# EasyEDA Pro project ProProject_aDataFlow_v2_pub_2024-01-13.epro, schematic SCH_conn_2.51
Create Date: 2024-01-03; Page Name: P1; Project Name: aDataFlow_v2_pub; Schematic Name: SCH_conn_2.51; Update Date: 2024-01-03; Company: AMAGSTY; Drawed: amagsty; Page Size: -; Part Number: -; Reviewed: -; Version: 2.5
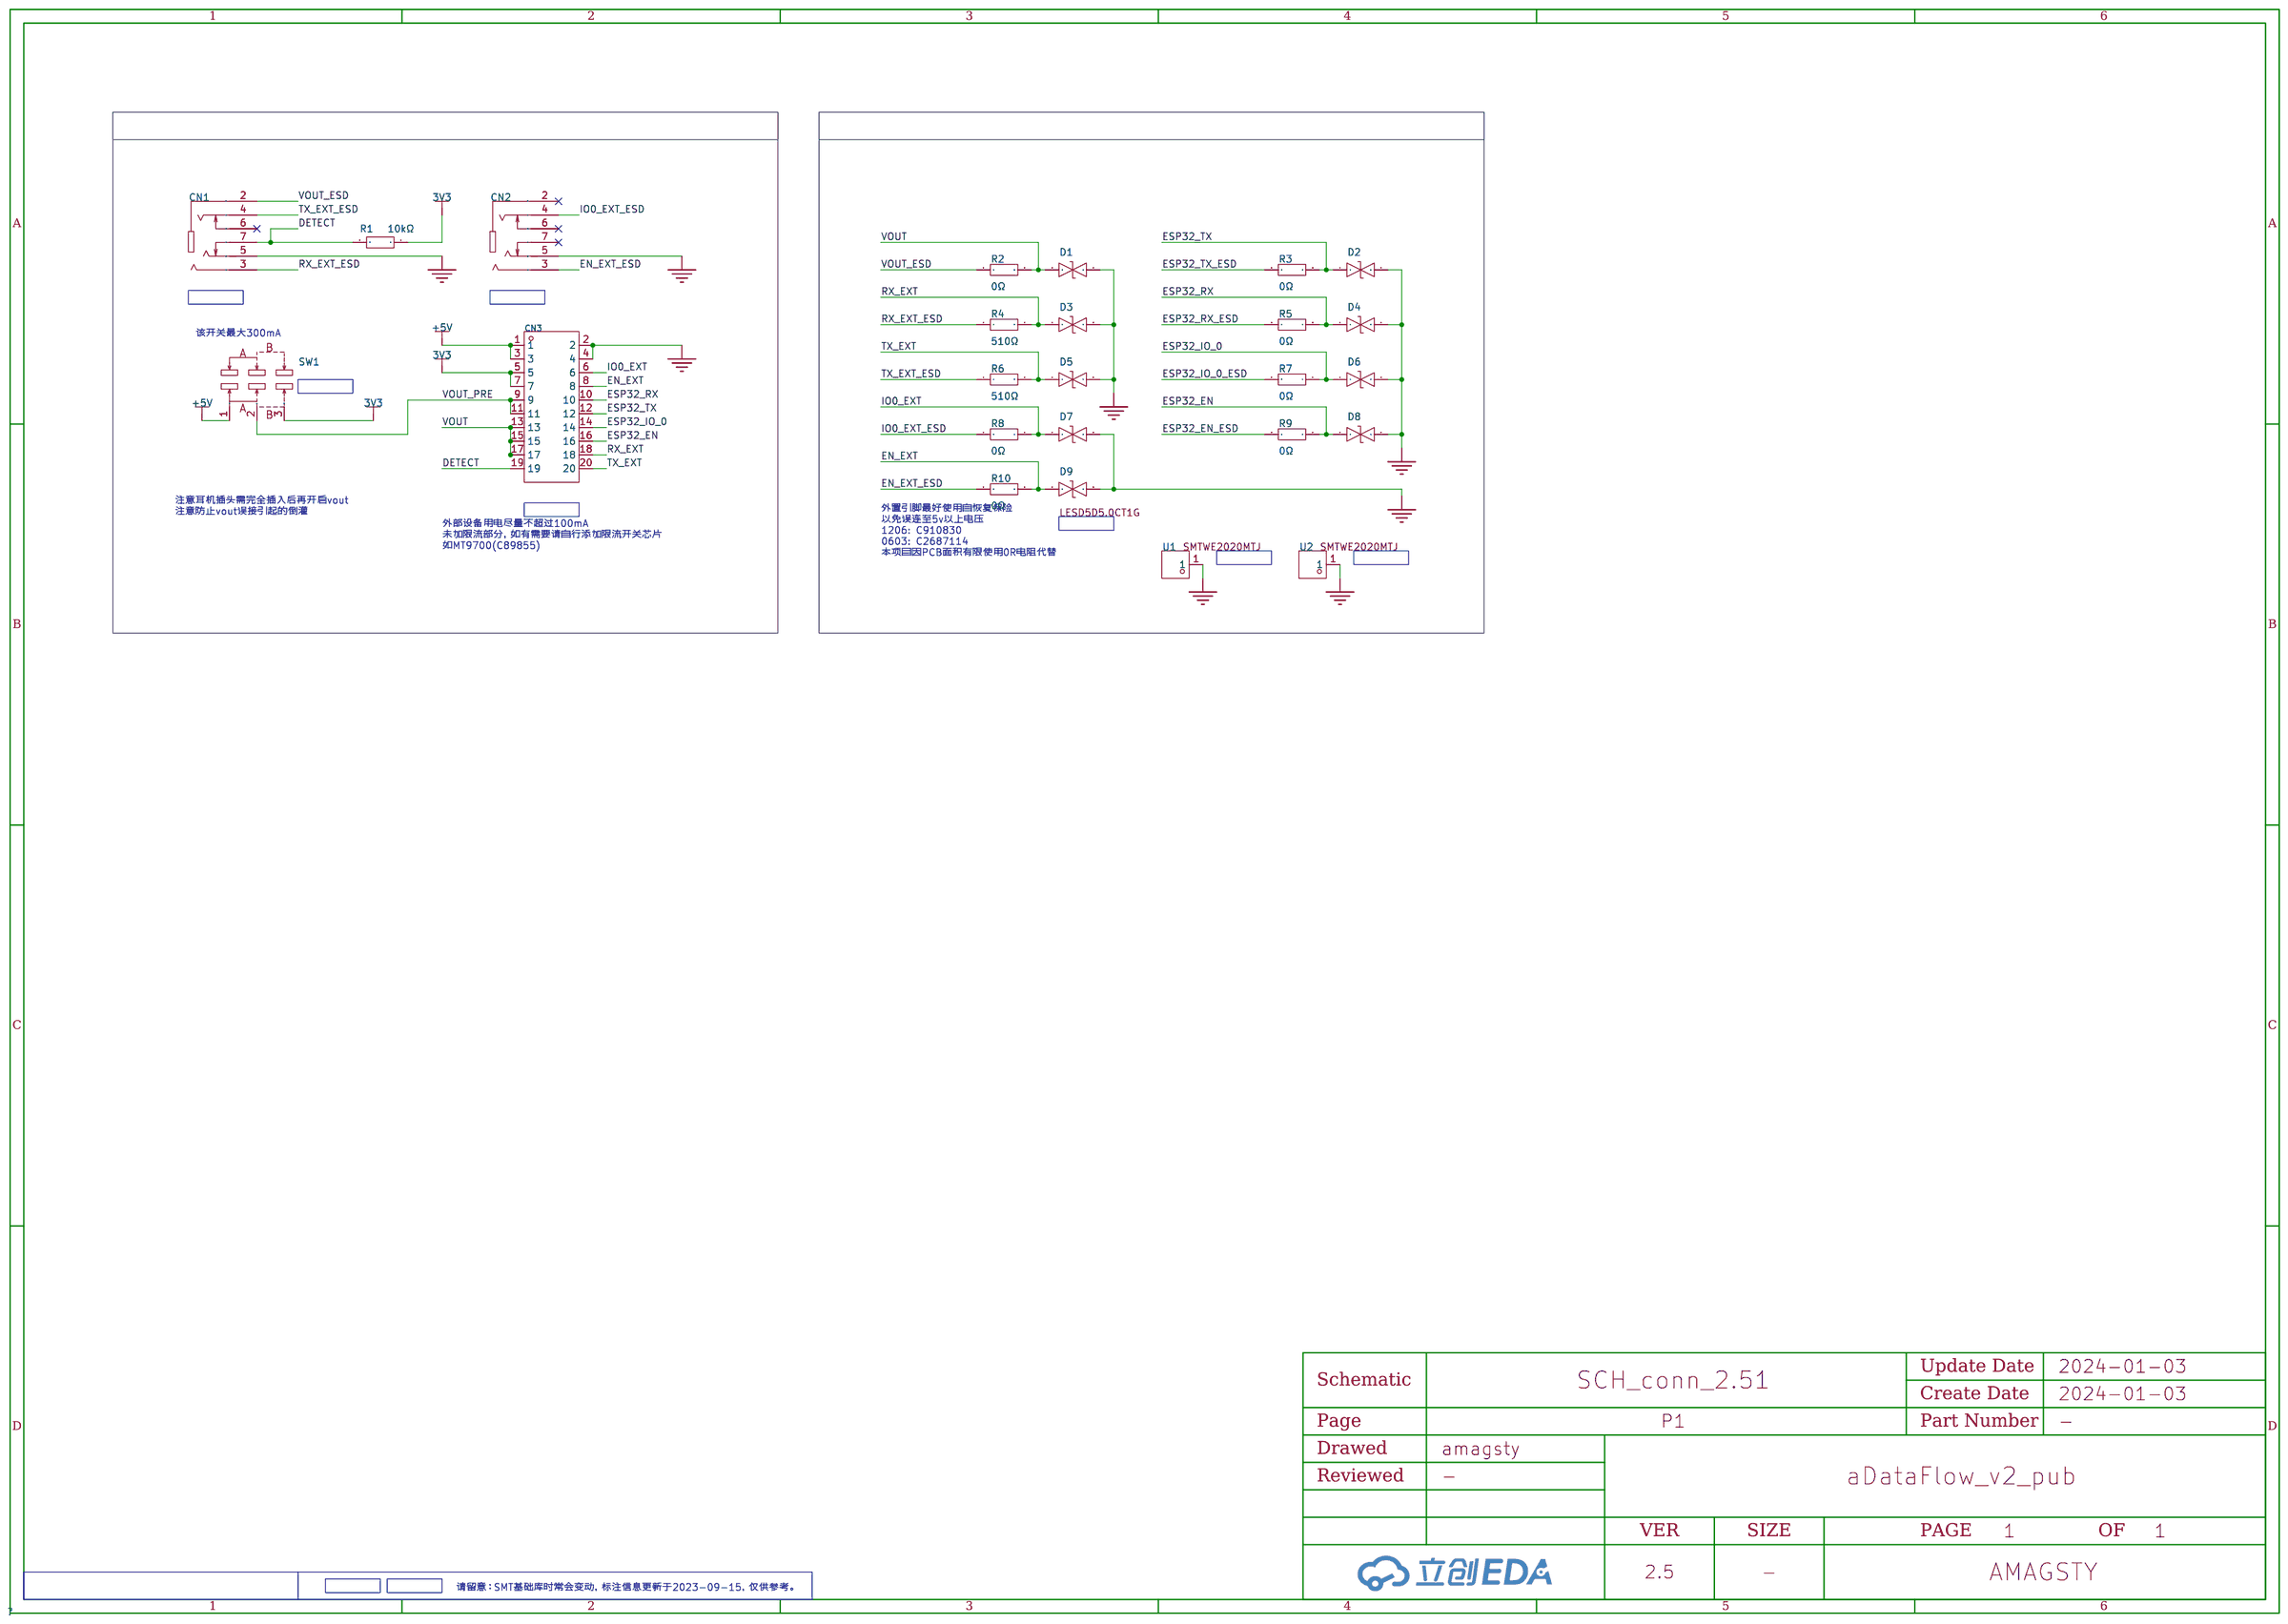
[diagram p0: schematic sheet]

## Parts
CN1  PJ-342  [AUDIO-SMD_PJ-342]
CN2  PJ-342  [AUDIO-SMD_PJ-342]
CN3  X0509FRS-20AS-LPV01  [CONN-SMD_20P-P0.50_XKB_X0509FRS-20ADS-LPV01]
D1  LESD5D5.0CT1G  [SOD-523_L1.2-W0.8-LS1.6-BI]
D2  LESD5D5.0CT1G  [SOD-523_L1.2-W0.8-LS1.6-BI]
D3  LESD5D5.0CT1G  [SOD-523_L1.2-W0.8-LS1.6-BI]
D4  LESD5D5.0CT1G  [SOD-523_L1.2-W0.8-LS1.6-BI]
D5  LESD5D5.0CT1G  [SOD-523_L1.2-W0.8-LS1.6-BI]
D6  LESD5D5.0CT1G  [SOD-523_L1.2-W0.8-LS1.6-BI]
D7  LESD5D5.0CT1G  [SOD-523_L1.2-W0.8-LS1.6-BI]
D8  LESD5D5.0CT1G  [SOD-523_L1.2-W0.8-LS1.6-BI]
D9  LESD5D5.0CT1G  [SOD-523_L1.2-W0.8-LS1.6-BI]
R1  10kΩ  [R0402]
R2  0Ω  [R0402]
R3  0Ω  [R0402]
R4  510Ω  [R0402]
R5  0Ω  [R0402]
R6  510Ω  [R0402]
R7  0Ω  [R0402]
R8  0Ω  [R0402]
R9  0Ω  [R0402]
R10  0Ω  [R0402]
SW1  K3-1280S-K1  [SW-SMD_K3-1280S-K1]
U1  SMTWE2020MTJ  [SMD_BD4.4-L4.4-D2.8]
U2  SMTWE2020MTJ  [SMD_BD4.4-L4.4-D2.8]

## Library data of the parts
CN1 CN2 = PJ-342_C668606: 连接器类型:3.5mm耳机座;额定电流:500mA;额定电压:30V;工作温度范围:-30℃~+70℃;; LCSC Part Name: 3.5mm耳机座; Supplier Part: C668606; Manufacturer: SHOU HAN(首韩); Supplier Footprint: SMD; JLCPCB Part Class: Extended Part; Datasheet: https://atta.szlcsc.com/upload/public/pdf/source/20200618/C668606_D9051A7D9D1D8CCDEAA76A8E7BC279ED.pdf; Supplier: LCSC; Connector Type: 3.5mm耳机座; Current Rating (Max): 500mA; Voltage Rating (Max): 30V; Operating Temperature Range: -30℃~+70℃
CN3 = X0509FRS-20AS-LPV01: PIN总数:20;间距:0.5mm;行数:2;公母:母;安装方式:卧贴;额定电流:3A;工作温度范围:-25℃~+85℃;; LCSC Part Name: PIN：20 间距0.5mm 母 卧贴; Supplier Part: C2925324; Manufacturer: XKB Connectivity(中国星坤); Supplier Footprint: SMD,P=0.5mm; JLCPCB Part Class: 扩展库; Supplier: LCSC; Number of Pins: 20; Pitch: 0.5mm; Number of Rows: 2; Gender: 母; Mounting Style: 卧贴; Current Rating (Max): 3A; Operating Temperature Range: -25℃~+85℃
D1-D9 = LESD5D5.0CT1G: 极性:双向;反向截止电压(Vrwm):5V;击穿电压(VBR):5.6V;钳位电压(Vc)@Ipp:18.6V;; LCSC Part Name: 双向ESD; Supplier Part: C383211; Manufacturer: LRC(乐山无线电); Supplier Footprint: SOD-523; JLCPCB Part Class: 扩展库; Datasheet: https://atta.szlcsc.com/upload/public/pdf/source/20190807/C383211_633DF4B4E2C161403226E5235FE33A1C.pdf; Supplier: LCSC; Polarity: 双向; Reverse Stand-Off Voltage (Vrwm): 5V; Breakdown Voltage (VBR): 5.6V; Peak Pulse Current(Ipp)@8/20us: 9.4A; Clamping Voltage@Ipp: 18.6V
R1 = 0402WGF1002TCE: 电阻类型:厚膜电阻;阻值:10kΩ;精度:±1%;功率:62.5mW;; LCSC Part Name: 10kΩ ±1% 62.5mW; Supplier Part: C25744; Manufacturer: UNI-ROYAL(厚声); Supplier Footprint: 0402; JLCPCB Part Class: 基础库; Datasheet: https://atta.szlcsc.com/upload/public/pdf/source/20200306/C422600_1E6D84923E4A46A82E41ADD87F860B5C.pdf; Supplier: LCSC; Type: 厚膜电阻; Tolerance: ±1%; Power(Watts): 62.5mW; Temperature Coefficient: ±100ppm/℃; Overload Voltage (Max): 50V; Operating Temperature Range: -55℃~+155℃
R2 R3 R5 R7-R10 = 0402WGF0000TCE: 电阻类型:厚膜电阻;阻值:0Ω;精度:±1%;功率:62.5mW;; LCSC Part Name: 0Ω ±1% 62.5mW; Supplier Part: C17168; Manufacturer: UNI-ROYAL(厚声); Supplier Footprint: 0402; JLCPCB Part Class: 基础库; Datasheet: https://atta.szlcsc.com/upload/public/pdf/source/20200306/C422600_1E6D84923E4A46A82E41ADD87F860B5C.pdf; Supplier: LCSC; Type: 厚膜电阻; Tolerance: ±1%; Power(Watts): 62.5mW; Temperature Coefficient: ±800ppm/℃; Overload Voltage (Max): 50V; Operating Temperature Range: -55℃~+155℃
R4 R6 = 0402WGF5100TCE: 阻值:510Ω;精度:±1%;功率:62.5mW;温度系数:±100ppm/℃;电阻类型:厚膜电阻;; LCSC Part Name: 510Ω ±1% 62.5mW 厚膜电阻; Supplier Part: C25123; Manufacturer: UNI-ROYAL(厚声); Supplier Footprint: 0402; JLCPCB Part Class: Basic Part; Datasheet: https://atta.szlcsc.com/upload/public/pdf/source/20200306/C422600_1E6D84923E4A46A82E41ADD87F860B5C.pdf; Supplier: LCSC; Tolerance: ±1%; Power(Watts): 62.5mW; Overload Voltage (Max): 50V; Temperature Coefficient: ±100ppm/℃; Type: 厚膜电阻; Operating Temperature Range: -55℃~+155℃
SW1 = K3-1280S-K1: 额定电流(DC):300mA;额定电压(DC):6V;额定电流(AC):-;额定电压(AC):-;电路结构:单刀双掷;安装方式:卧贴;机械寿命:1万次;开关颜色:黑色;; LCSC Part Name: 卧贴双档 滑动开关; Supplier Part: C128953; Manufacturer: 韩国韩荣; Supplier Footprint: SMD; JLCPCB Part Class: Extended Part; Datasheet: https://atta.szlcsc.com/upload/public/pdf/source/20210810/123CC646CF72A23B462032535BCF4159.pdf; Supplier: LCSC; Current Rating (DC): 300mA; Voltage Rating (DC): 6V; Circuit: 单刀双掷; Mounting Style: 卧贴; Mechanical Life: 1万次; Actuator Color: 黑色; Actuator Style: 矩形柱状; Pin Style: 鸥翼型; Operating Temperature: -25℃~+80℃; Switch Length: 9.1mm; Switch Width: 3.7mm; Switch Height: 3.5mm
U1 U2 = SMTWE2020MTJ: M2x4.35xL2+1.4; LCSC Part Name: 雄和远景，电路板表贴圆螺母柱，M2X2，铁镀锡; Supplier Part: C2928177; Manufacturer: Sinhoo(雄和远景); JLCPCB Part Class: 扩展库; Datasheet: https://atta.szlcsc.com/upload/public/pdf/source/20211216/9F87D56F723C430AF11DB5F4781E386A.pdf; Supplier: LCSC

## Nets
3V3: CN3.5 CN3.7 R1.1 SW1.3
+5V: CN3.1 CN3.3 SW1.1
GND: CN1.5 CN2.5 CN3.2 CN3.4 D1.2 D2.2 D3.2 D4.2 D5.2 D6.2 D7.2 D8.2 D9.2 U1.1 U2.1
DETECT: CN1.7 CN3.19 R1.2
EN_EXT: CN3.8 D9.1 R10.1
EN_EXT_ESD: CN2.3 R10.2
ESP32_EN: CN3.16 D8.1 R9.1
ESP32_EN_ESD: R9.2
ESP32_IO_0: CN3.14 D6.1 R7.1
ESP32_IO_0_ESD: R7.2
ESP32_RX: CN3.10 D4.1 R5.2
ESP32_RX_ESD: R5.1
ESP32_TX: CN3.12 D2.1 R3.2
ESP32_TX_ESD: R3.1
IO0_EXT: CN3.6 D7.1 R8.1
IO0_EXT_ESD: CN2.4 R8.2
RX_EXT: CN3.18 D3.1 R4.2
RX_EXT_ESD: CN1.3 R4.1
TX_EXT: CN3.20 D5.1 R6.2
TX_EXT_ESD: CN1.4 R6.1
VOUT: CN3.13 CN3.15 CN3.17 D1.1 R2.2
VOUT_ESD: CN1.2 R2.1
VOUT_PRE: CN3.9 CN3.11 SW1.2

Not connected (* = marked no-connect by the designer): CN1 6*; CN2 2* 6* 7*

## Notes on the sheet
- CONN_EXT
- TVS
- SMT_EXT
- SMT_EXT
- 该开关最大300mA
- SMT_EXT
- 注意耳机插头需完全插入后再开启vout
  注意防止vout误接引起的倒灌
- SMT_EXT
- SMT_EXT
- 外部设备用电尽量不超过100mA
  未加限流部分，如有需要请自行添加限流开关芯片
  如MT9700(C89855)
- 外置引脚最好使用自恢复保险
  以免误连至5v以上电压
  1206: C910830
  0603: C2687114
  本项目因PCB面积有限使用0R电阻代替
- SMT_EXT
- SMT_EXT
- SMT_BASE
- SMT_EXT
- PCB: 黑色，1.6mm
- 请留意：SMT基础库时常会变动，标注信息更新于2023-09-15，仅供参考。
